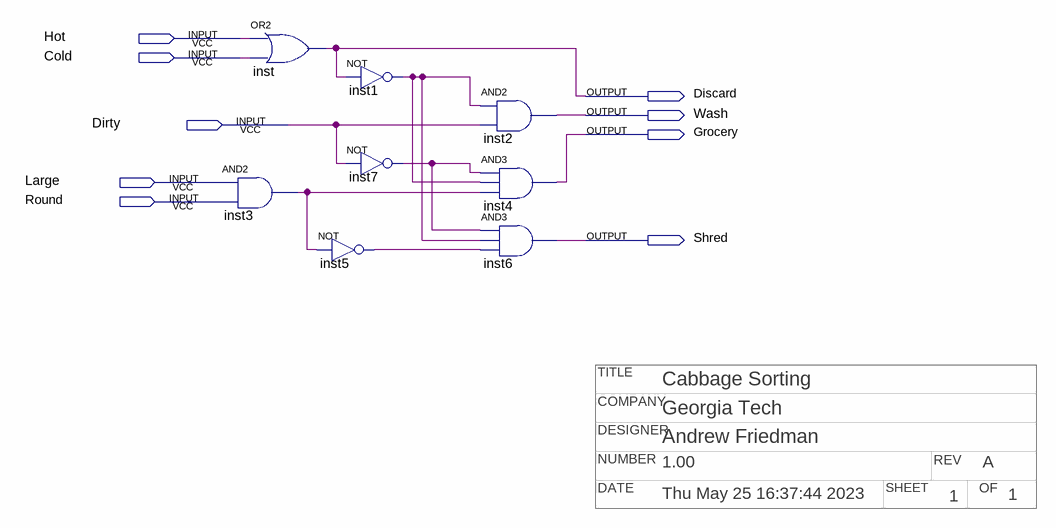
[diagram p0: schematic sheet]
// Quartus schematic CabbageSorting.bdf as structural Verilog: 8 symbols, 9 pins
// Title block: COMPANY: Georgia Tech; DATE: Thu May 25 16:37:44 2023; DESIGNER: Andrew Friedman; NUMBER: 1.00; OF: 1; REV: A; SHEET: 1; TITLE: Cabbage Sorting
module CabbageSorting (
  input  Hot,
  input  Cold,
  input  Dirty,
  input  Large,
  input  Round,
  output Discard,
  output Wash,
  output Grocery,
  output Shred
);

  wire inst1_out, inst3_out, inst5_out, inst7_out;

  or inst (Discard, Hot, Cold);
  and inst3 (inst3_out, Large, Round);
  not inst1 (inst1_out, Discard);
  not inst7 (inst7_out, Dirty);
  not inst5 (inst5_out, inst3_out);
  and inst2 (Wash, inst1_out, Dirty);
  and inst4 (Grocery, inst7_out, inst1_out, inst3_out);
  and inst6 (Shred, inst7_out, inst1_out, inst5_out);
endmodule
